# EAGLE design tophat (EAGLE 9.4.2)
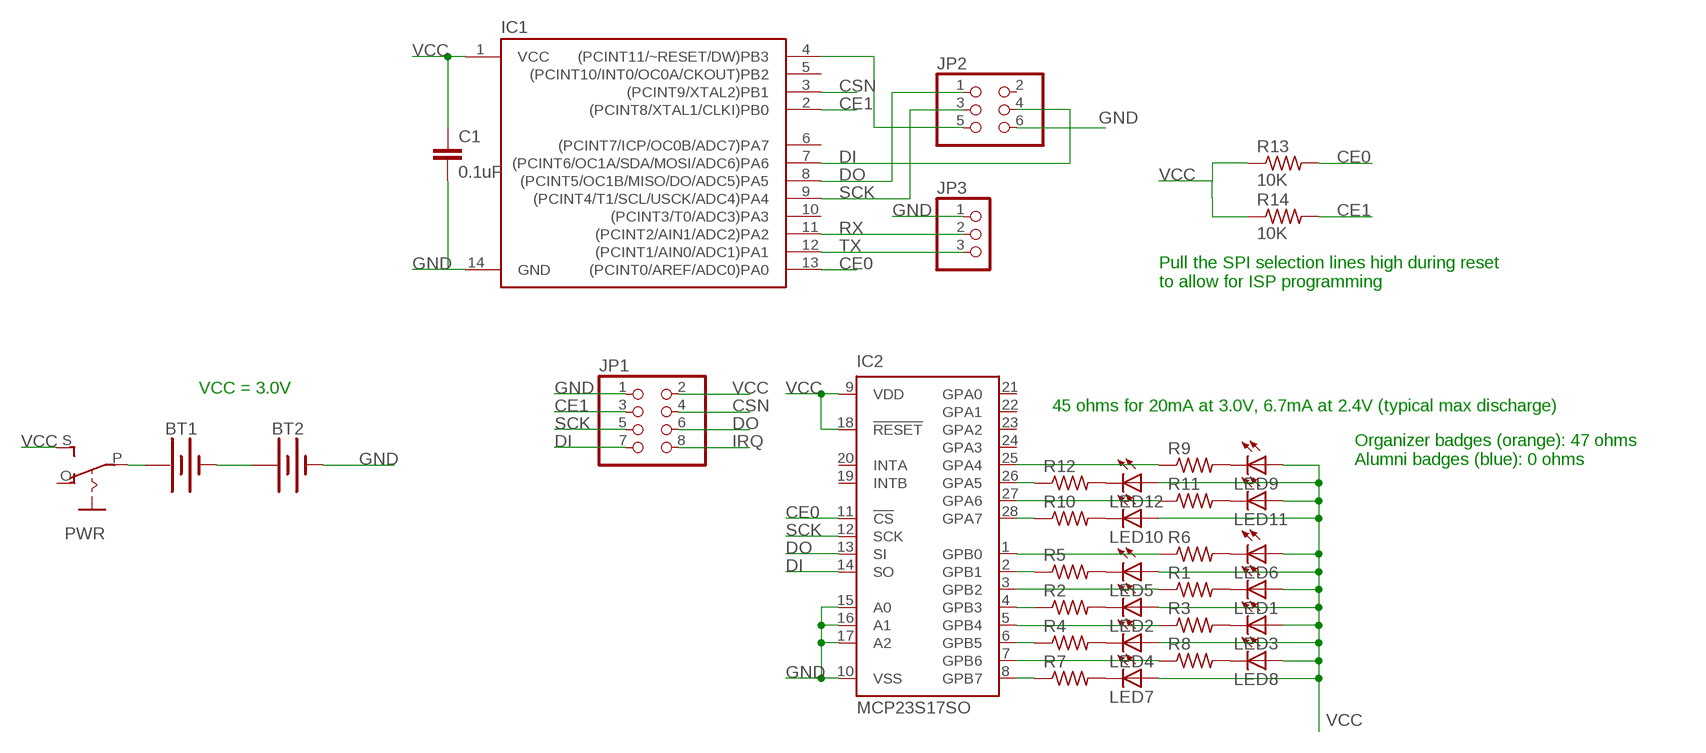
[diagram p0: schematic, sheet 1]

## Parts
BT1  BATTERY-AA-SMD  [BATTERY-AA-SMD]
BT2  BATTERY-AA-SMD  [BATTERY-AA-SMD]
C1  0.1uF  C-EUC1206  [C1206]
IC1  ATTINY84  [SO14]
IC2  MCP23S17SO  [SO28W]
JP1  PINHD-2X4/90  [2X04/90]
JP2  PINHD-2X3  [2X03]
JP3  PINHD-1X3  [1X03]
LED1  LEDSMT1206  [1206]
LED2  LEDSMT1206  [1206]
LED3  LEDSMT1206  [1206]
LED4  LEDSMT1206  [1206]
LED5  LEDSMT1206  [1206]
LED6  LEDSMT1206  [1206]
LED7  LEDSMT1206  [1206]
LED8  LEDSMT1206  [1206]
LED9  LEDSMT1206  [1206]
LED10  LEDSMT1206  [1206]
LED11  LEDSMT1206  [1206]
LED12  LEDSMT1206  [1206]
PWR  EG1218S  [EG1218]
R1  R-US_R1206  [R1206]
R2  R-US_R1206  [R1206]
R3  R-US_R1206  [R1206]
R4  R-US_R1206  [R1206]
R5  R-US_R1206  [R1206]
R6  R-US_R1206  [R1206]
R7  R-US_R1206  [R1206]
R8  R-US_R1206  [R1206]
R9  R-US_R1206  [R1206]
R10  R-US_R1206  [R1206]
R11  R-US_R1206  [R1206]
R12  R-US_R1206  [R1206]
R13  10K  R-US_R1206  [R1206]
R14  10K  R-US_R1206  [R1206]

## Nets
CE0: IC1.13((PCINT0/AREF/ADC0)PA0) IC2.11(!CS) R13.2
CE1: IC1.2((PCINT8/XTAL1/CLKI)PB0) JP1.3 R14.2
CSN: IC1.3((PCINT9/XTAL2)PB1) JP1.4
DI: IC1.7((PCINT6/OC1A/SDA/MOSI/ADC6)PA6) IC2.14(SO) JP1.7 JP2.4
DO: IC1.8((PCINT5/OC1B/MISO/DO/ADC5)PA5) IC2.13(SI) JP1.6 JP2.1
GND: BT2.P$2(-) BT2.P$4(-) C1.2 IC1.14(GND) IC2.10(VSS) IC2.15(A0) IC2.16(A1) IC2.17(A2) JP1.1 JP2.6 JP3.1
IRQ: JP1.8
N$1: BT1.P$2(-) BT1.P$4(-) BT2.P$1(+) BT2.P$3(+)
N$2: BT1.P$1(+) BT1.P$3(+) PWR.P
N$3: IC2.28(GPA7) R10.1
N$5: IC2.27(GPA6) R11.1
N$6: LED1.C R1.2
N$7: LED2.C R2.2
N$8: LED3.C R3.2
N$9: LED4.C R4.2
N$10: LED5.C R5.2
N$11: LED6.C R6.2
N$12: LED7.C R7.2
N$13: LED8.C R8.2
N$14: IC2.26(GPA5) R12.1
N$15: IC2.25(GPA4) R9.1
N$16: IC2.8(GPB7) R7.1
N$17: IC2.1(GPB0) R6.1
N$18: IC2.2(GPB1) R5.1
N$19: IC2.3(GPB2) R1.1
N$20: IC2.4(GPB3) R2.1
N$21: IC2.5(GPB4) R3.1
N$22: IC2.6(GPB5) R4.1
N$23: IC2.7(GPB6) R8.1
N$69: LED9.C R9.2
N$70: LED10.C R10.2
N$71: LED11.C R11.2
N$72: LED12.C R12.2
RST: IC1.4((PCINT11/~RESET/DW)PB3) JP2.5
RX: IC1.11((PCINT2/AIN1/ADC2)PA2) JP3.2
SCK: IC1.9((PCINT4/T1/SCL/USCK/ADC4)PA4) IC2.12(SCK) JP1.5 JP2.3
TX: IC1.12((PCINT1/AIN0/ADC1)PA1) JP3.3
VCC: C1.1 IC1.1(VCC) IC2.9(VDD) IC2.18(!RESET) JP1.2 LED1.A LED2.A LED3.A LED4.A LED5.A LED6.A LED7.A LED8.A LED9.A LED10.A LED11.A LED12.A PWR.S R13.1 R14.1
Unconnected: IC1.5((PCINT10/INT0/OC0A/CKOUT)PB2) IC1.6((PCINT7/ICP/OC0B/ADC7)PA7) IC1.10((PCINT3/T0/ADC3)PA3) IC2.19(INTB) IC2.20(INTA) IC2.21(GPA0) IC2.22(GPA1) IC2.23(GPA2) IC2.24(GPA3) JP2.2 PWR.O

## Notes on the sheet
- Pull the SPI selection lines high during reset
  to allow for ISP programming
- VCC = 3.0V
- 45 ohms for 20mA at 3.0V, 6.7mA at 2.4V (typical max discharge)
- Organizer badges (orange): 47 ohms
  Alumni badges (blue): 0 ohms

## Library data of the parts
BT1 BT2 = Batteries:BATTERY: Battery - Single Cell A variety of battery chemistries, sizes, and footprints. Device List: 20MM_PTH - Coin Cell Battery Holder - 20mm (PTH) <https://www.sparkfun.com/products/783> 6.8MM_PTH - Coin Cell Battery Holder - 6.8MM(SMD) <https://www.digikey.com/product-detail/en/seiko-instruments/MS621FE-FL11E/728-1057-ND/1889208?WT.srch=1&gclid=CNOQ5a6LzdQCFZS2wAodXCkE0g> 12MM_SMD - Coin Cell Battery Holder - 12mm (SMD) <https://www.sparkfun.com/products/10592> 12MM_PTH - Coin Cell Battery Holder - 12mm (PTH) <https://www.sparkfun.com/products/7948> 20MM_SMD - 20mm Coin Cell Battery Holder (SMD) (2 legs) Used on the Big Time Watch Kit <https://www.sparkfun.com/products/11734> 20MM_SMD_4LEGS - Coin Cell Battery Holder - 20mm (SMD) <https://www.sparkfun.com/products/11892> 20MM_SMD_4LEGS_OVERPASTE - Coin Cell Battery Holder - 20mm (SMD) <https://www.sparkfun.com/products/11892> (Over-paste on the legs) 24.5MM_PTH - Coin Cell Battery Holder - 24.5mm (PTH) <https://www.sparkfun.com/products/8863> 9V - 9V Battery Holder - PC Mount Used on the SparkFun SparkPunk Sound Kit <https://www.sparkfun.com/products/11177> and SparkFun SparkPunk Sequencer Kit <https://www.sparkfun.com/products/12707> 18650 - Battery Holder - 18650 (PTH) <https://www.sparkfun.com/products/13113> AA - Battery Holder - 1xAA (PTH) <https://www.sparkfun.com/products/7949> AAA - Battery Holder - 1xAAA (PTH) <https://www.sparkfun.com/products/12718> AA_KIT - Battery Holder - 1xAA (PTH) <https://www.sparkfun.com/products/7949> Special kit package - pads only have exposed copper on one side of the board. AAA_KIT - Battery Holder - 1xAAA (PTH) <https://www.sparkfun.com/products/12718> Special kit package - pads only have exposed copper on one side of the board.
C1 = rcl:C-EU: CAPACITOR, European symbol; SPICEPREFIX: C
IC1 = SparkFun-IC-Microcontroller:ATTINY84: Atmel 14-pin 2/4/8kB flash uC Datasheet <https://cdn.sparkfun.com/datasheets/Widgets/doc8006.pdf> SparkFun Products Tiny AVR Programmer <https://www.sparkfun.com/products/11801> (PGM-11801) SparkFun Servo Trigger - Continuous Rotation <https://www.sparkfun.com/products/13872> (WIG-13872) SparkFun Servo Trigger <https://www.sparkfun.com/products/13118> (WIG-13118); PROD_ID: IC-11285
IC2 = microchip:MCP23S17: http://ww1.microchip.com/downloads/en/DeviceDoc/21952a.pdf Source: http://ww1.microchip.com/downloads/en/DeviceDoc/21952a.pdf; MF: MICROCHIP; MPN: MCP23S17-E/SO; OC_FARNELL: unknown; OC_NEWARK: 31K2950
JP1 = pinhead:PINHD-2X4: PIN HEADER
JP2 = pinhead:PINHD-2X3: PIN HEADER
JP3 = adafruit:PINHD-1X3: PIN HEADER
LED1-LED12 = adafruit:LED: LED OSRAM: - CHIPLED LG R971, LG N971, LY N971, LG Q971, LY Q971, LO R971, LY R971 LH N974, LH R974 LS Q976, LO Q976, LY Q976 LO Q996 - Hyper CHIPLED LW Q18S LB Q993, LB Q99A, LB R99A - SideLED LS A670, LO A670, LY A670, LG A670, LP A670 LB A673, LV A673, LT A673, LW A673 LH A674 LY A675 LS A676, LA A676, LO A676, LY A676, LW A676 LS A679, LY A679, LG A679 - Hyper Micro SIDELED® LS Y876, LA Y876, LO Y876, LY Y876 LT Y87S - SmartLED LW L88C, LW L88S LB L89C, LB L89S, LG L890 LS L89K, LO L89K, LY L89K LS L896, LA L896, LO L896, LY L896 - TOPLED LS T670, LO T670, LY T670, LG T670, LP T670 LSG T670, LSP T670, LSY T670, LOP T670, LYG T670 LG T671, LOG T671, LSG T671 LB T673, LV T673, LT T673, LW T673 LH T674 LS T676, LA T676, LO T676, LY T676, LB T676, LH T676, LSB T676, LW T676 LB T67C, LV T67C, LT T67C, LS T67K, LO T67K, LY T67K, LW E67C LS E67B, LA E67B, LO E67B, LY E67B, LB E67C, LV E67C, LT E67C LW T67C LS T679, LY T679, LG T679 LS T770, LO T770, LY T770, LG T770, LP T770 LB T773, LV T773, LT T773, LW T773 LH T774 LS E675, LA E675, LY E675, LS T675 LS T776, LA T776, LO T776, LY T776, LB T776 LHGB T686 LT T68C, LB T68C - Hyper Mini TOPLED® LB M676 - Mini TOPLED Santana® LG M470 LS M47K, LO M47K, LY M47K Source: http://www.osram.convergy.de/
PWR = adafruit:EG1218: SLIDING SWITCH 0.1" spacing through hole, vertical SPDT slide switch http://www.ladyada.net/library/pcb/eaglelibrary.html
R1-R14 = rcl:R-US_: RESISTOR, American symbol; SPICEPREFIX: R

## Board
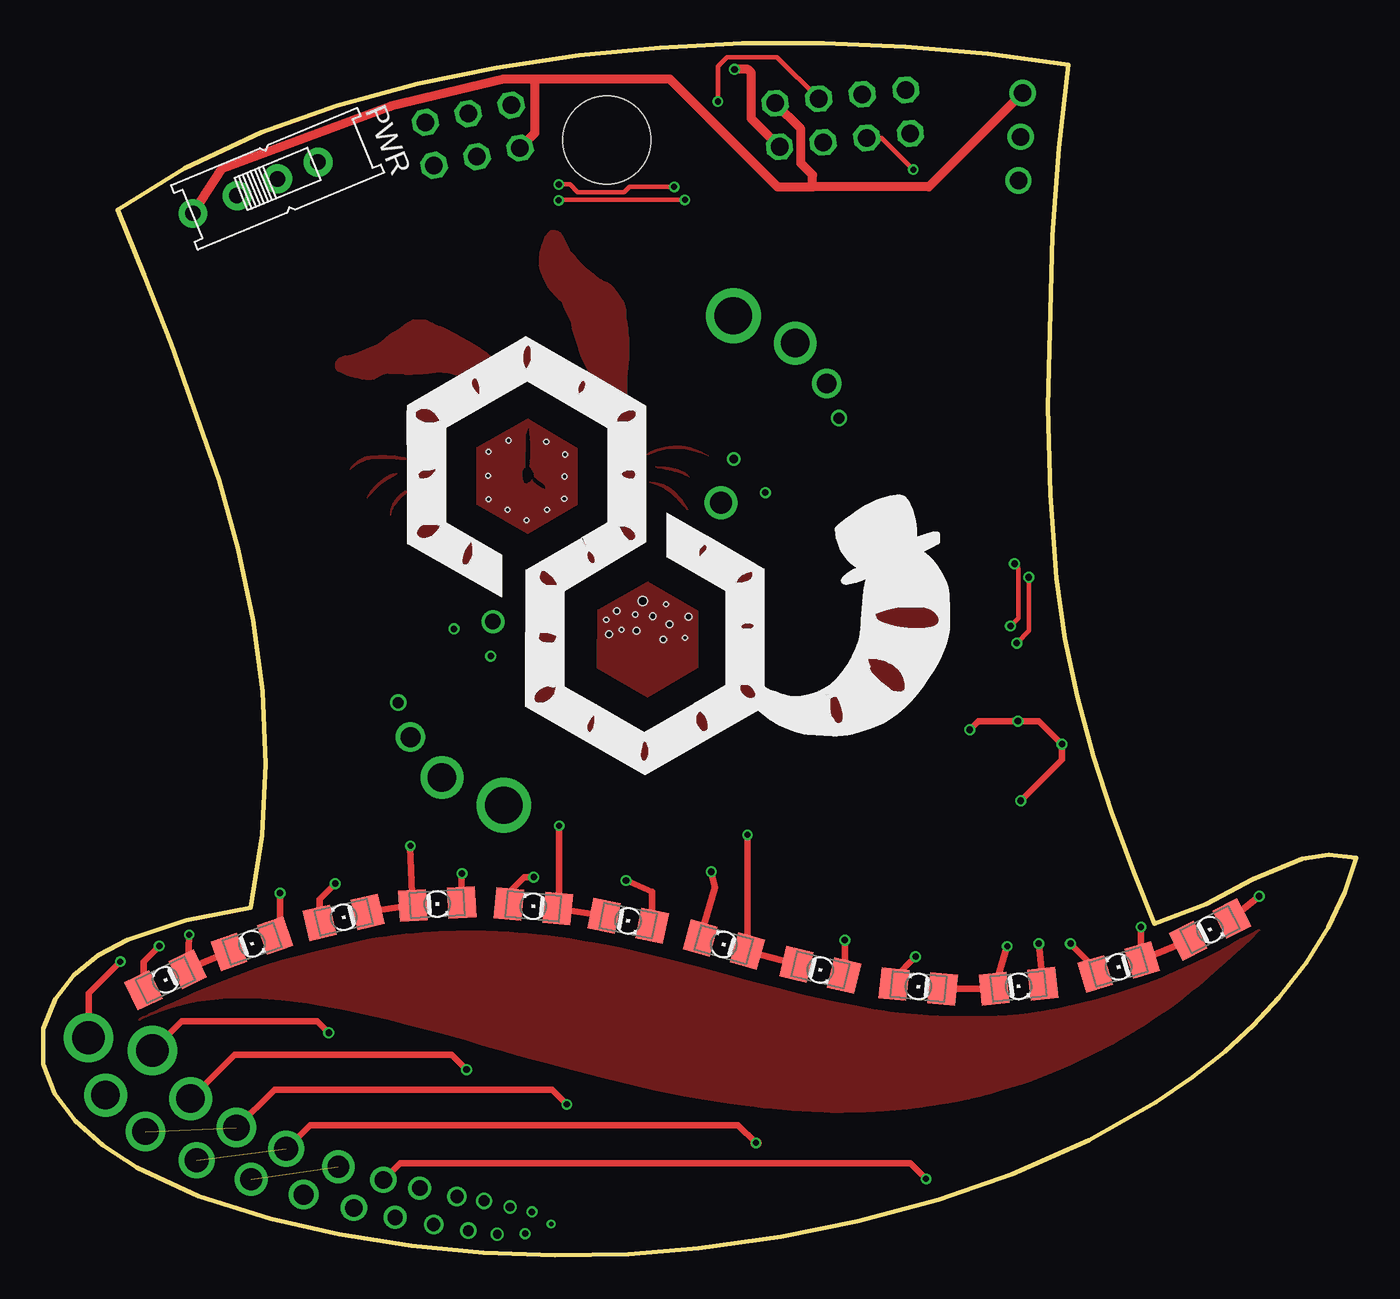
[diagram p1: board, top side]
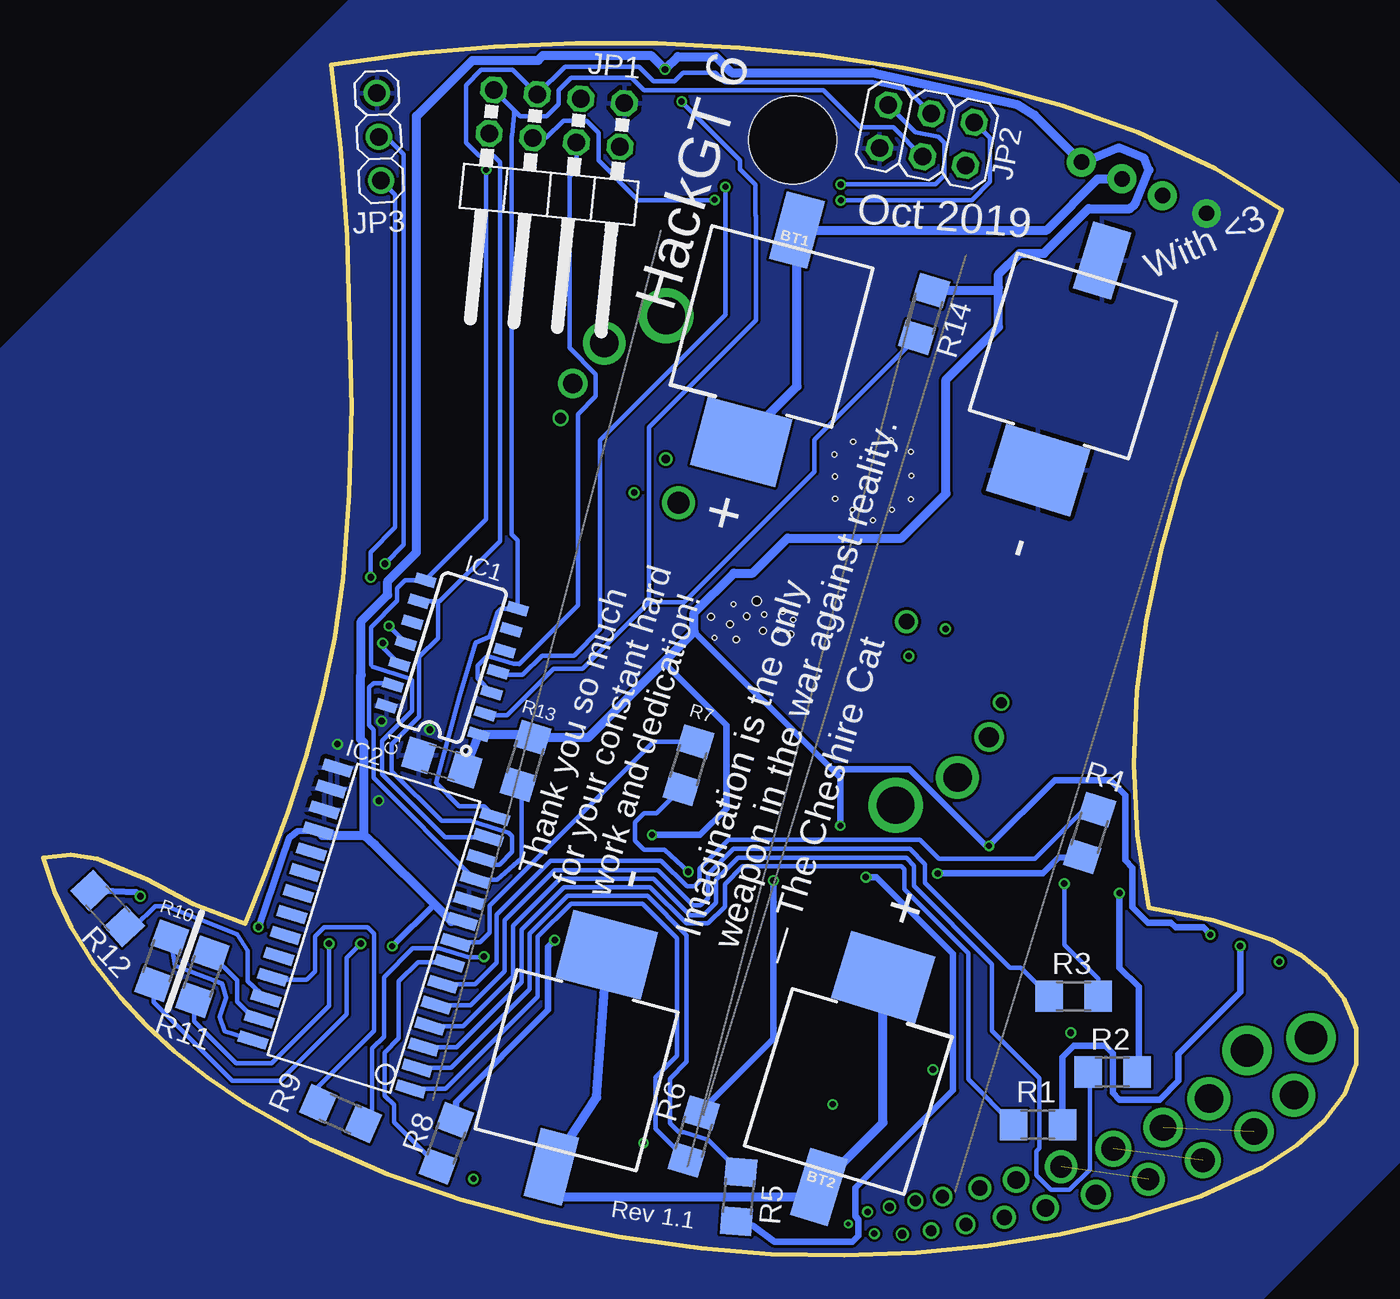
[diagram p2: board, bottom side, seen from below]

Size 76.15 x 70.27 mm. Coordinates in mm from the lower left corner, seen from the top.
Outline: 70.15,21.81 67.43,20.35 64.44,19.23 63.25,22.21 61.94,25.72 60.9,28.92 59.95,32.39 59.26,35.74 58.76,39.24 58.41,44.13 58.26,49.17 58.51,59.11 58.9,64.18 59.44,69 54.78,69.65 50.01,70.07 45.28,70.27 40.53,70.25 35.76,70.01 31.06,69.56 26.3,68.85 21.72,67.92 17.02,66.64 12.66,65.1 8.2,63.03 4.32,60.61 5.85,56.82 7.43,52.84 10.21,44.94 11.32,40.94 12.18,36.81 12.72,32.69 12.9,28.48 12.69,24.36 12.04,20.16 8.3,19.43 4.9,18.31 3.2,17.39 1.78,16.25 0.7,14.84 0,13.12 0,11.09 0.69,9.38 1.85,7.8 3.46,6.38 5.44,5.09 9.02,3.44 13.19,2.11 17.18,1.21 21.37,0.56 25.53,0.17 29.68,0 33.95,0.07 37.99,0.4 42.78,1.09 47.21,1.98 51.92,3.24 56.17,4.7 60.65,6.69 64.53,8.89 66.63,10.33 68.51,11.82 70.18,13.36 71.65,14.92 73.24,16.96 74.51,19.01 75.48,21.04 76.15,23.05 74.53,23.21 73.02,23 70.15,21.81
Copper layers (1*16): Top 0.035559375mm / dielectric 1.6mm / Bottom 0.035559375mm
Design rules "oshpark-2layer *": minimum track width 10mil, minimum drill 10mil, track to track 6mil, track to pad 6mil, pad to pad 6mil, via to via 6mil, smd to smd 6mil, copper to edge 0mil, drill to drill 6mil, minimum pad ring 5mil, minimum via ring 5mil, stop-mask expansion 2.5mil, vias tented up to drill 0mil, thermal gap 10mil
Holes 0.25 mm at 26.99,47.23 25.8,45.2 25.82,46.57 25.82,43.83 26.94,43.22 28.03,42.61 29.23,43.22 30.22,43.85 30.24,45.15 30.27,46.42 29.18,47.16 32.66,36.84 33.54,36.26 34.33,37.15 37.23,35.8 36.11,37.73
Holes 0.51 mm at 34.76,37.94
Holes 0.36 mm at 35.35,37.05 36.31,36.59 37.43,37.02 35.96,35.7 34.41,36.21 33.27,37.35 32.81,36.01
Holes 5.08 mm at 32.68,64.66
bKeepout: area 40.5,39 to 58.6,69.4
tRestrict: area 27.8,44.5 to 29.1,47.9

### Footprints (pad centres in the part's own frame; a part is rotated, then mirrored left to right if it is on the bottom)
BATTERY-AA-SMD = smd 4.064 x 2.286: P$1 -28.067,0; P$2 28.067,0 | smd 4.064 x 5.08: P$3 -15.367,0; P$4 15.367,0
C1206 = smd 1.6 x 1.8: 1 -1.4,0; 2 1.4,0
SO14 = smd 0.6 x 1.2: 1 -3.175,-2.8; 2 -1.905,-2.8; 3 -0.635,-2.8; 4 0.635,-2.8; 5 1.905,-2.8; 6 3.175,-2.8; 7 4.445,-2.8; 8 4.445,2.8; 9 3.175,2.8; 10 1.905,2.8; 11 0.635,2.8; 12 -0.635,2.8; 13 -1.905,2.8; 14 -3.175,2.8
SO28W = smd 0.65 x 1.7: 1 -7.62,-4.78; 2 -6.35,-4.78; 3 -5.08,-4.78; 4 -3.81,-4.78; 5 -2.54,-4.78; 6 -1.27,-4.78; 7 0,-4.78; 8 1.27,-4.78; 9 2.54,-4.78; 10 3.81,-4.78; 11 5.08,-4.78; 12 6.35,-4.78; 13 7.62,-4.78; 14 8.89,-4.78; 15 8.89,4.78; 16 7.62,4.78; 17 6.35,4.78; 18 5.08,4.78; 19 3.81,4.78; 20 2.54,4.78; 21 1.27,4.78; 22 0,4.78; 23 -1.27,4.78; 24 -2.54,4.78; 25 -3.81,4.78; 26 -5.08,4.78; 27 -6.35,4.78; 28 -7.62,4.78
2X04/90 = drill 1.016 octagon: 1 -3.81,-6.35; 2 -3.81,-3.81; 3 -1.27,-6.35; 4 -1.27,-3.81; 5 1.27,-6.35; 6 1.27,-3.81; 7 3.81,-6.35; 8 3.81,-3.81
2X03 = drill 1.016 octagon: 1 -2.54,-1.27; 2 -2.54,1.27; 3 0,-1.27; 4 0,1.27; 5 2.54,-1.27; 6 2.54,1.27
1X03 = drill 1.016: 1 -2.54,0; 2 0,0; 3 2.54,0
1206 = smd 1.6 x 1.803: A -1.422,0; C 1.422,0
EG1218 = drill 0.9 pad 1.676: O -2.54,0; P 0,0; S 2.54,0
R1206 = smd 1.6 x 1.803: 1 -1.422,0; 2 1.422,0

### Placement (x,y rotation side)
BT1  39.56,32.28 255.3 bottom
BT2  22.95,30.82 73 bottom
C1  53.03,28.57 162.8 bottom
IC1  52.63,34.06 72.8 bottom
IC2  57.15,18.35 72.8 bottom
JP1  46.88,60.85 174.2 bottom
JP2  24.9,64.93 168.6 bottom
JP3  56.67,64.83 272.7 bottom
LED1  7.1,15.97 205.4 top
LED2  12.11,18.07 19.3 top
LED3  17.43,19.6 193 top
LED4  22.85,20.37 3.3 top
LED5  28.42,20.23 174.6 top
LED6  33.92,19.4 348.5 top
LED7  39.47,18.02 164.6 top
LED8  45.06,16.55 346.5 top
LED9  50.75,15.58 174.4 top
LED10  56.56,15.6 6.1 top
LED11  62.35,16.72 196.5 top
LED12  67.65,18.89 27 top
PWR  13.59,62.4 22.5 top
R1  18.46,7.58 0 bottom
R2  14.14,10.63 0 bottom
R3  16.39,15.02 0 bottom
R4  15.47,24.48 252.2 bottom
R5  35.82,3.41 265.1 bottom
R6  38.42,6.89 72.9 bottom
R7  38.73,28.41 253 bottom
R8  52.77,6.5 69.9 bottom
R9  58.9,8.22 336.3 bottom
R10  69.26,17.08 250.3 bottom
R11  66.91,16.16 250.9 bottom
R12  72.4,20.11 132.8 bottom
R13  48.18,28.67 253 bottom
R14  25.06,54.57 253 bottom

### Tracks (layer width: path | path; a pad name or v marks a point on that pad's centre or on a via)
CE0
  Bottom 0.254: IC1.13 55.97,33.17 57,33.17 57.23,32.94 57.23,30.72 56.98,30.47 56.98,27.68 IC2.11 49.81,21.79 48.4,23.01 48.4,27.11 R13.2
CE1  (via drill 0.35)
  Top 0.254: JP1.3 42.56,69.46 39.65,69.46 39.12,68.93 v39.12,66.88
  Bottom 0.254: 41.02,37.85 44.87,34 46.56,34 49.24,31.32 50.43,31.32 | 41.02,37.85 41.02,48.01 34.82,54.21 34.82,60.26 34.83,60.27 34.83,62.05 35.73,62.96 35.73,63.49 v39.12,66.88 | 41.02,37.85 38.99,37.85 31.41,45.43 31.41,47.28 R14.2
  Bottom 0.381: IC1.2 50.43,31.32
CSN
  Bottom 0.254: JP1.4 45.23,62.94 45.64,62.53 45.64,52.6 44.12,51.08 44.12,49.79 45.14,48.77 45.14,37.69 48.56,34.27 48.57,34.28 48.88,34.28 50.24,34.7 50.44,34.7 50.97,34.18 50.97,33.45 IC1.3
DI
  Bottom 0.254: 48.83,66.36 48.49,66.02 46.97,66.02 46.26,66.73 46.26,67.52 45.53,68.26 42.04,68.26 41.3,67.53 30.9,67.53 28.76,65.38 26.85,65.38 JP2.4 | 48.83,66.36 JP1.7 | 48.83,66.36 48.83,66.12 48.96,64.89 48.98,64.87 48.98,41.8 48.64,41.47 IC1.7 49.6,37.47 49.84,37.24 49.84,37.19 50.25,35.86 51.07,35.51 51.99,32.41 53.37,27.4 52.02,26.05 50.58,26.05 IC2.14
DO  (via drill 0.35)
  Top 0.254: v50.46,62.93 48.61,64.77 JP1.6 | v37.21,61.18 29.92,61.18 v29.89,61.15
  Bottom 0.254: v50.46,62.93 50.46,42.66 IC1.8 55.17,39.13 55.61,38.68 55.61,37.94 57.14,36.41 57.14,34.23 57.03,34.11 54.85,33.44 | JP1.6 46.97,64.77 45.97,65.77 44.65,65.77 43.94,65.06 43.94,63.47 41.64,61.17 v37.22,61.17 v37.21,61.18 | IC2.13 50.36,24.24 52.84,24.24 56.49,27.89 56.49,29.83 54.75,31.57 54.75,33.33 54.85,33.44 | 54.85,33.44 | JP2.1 21.26,64.77 21.26,62.22 22.31,61.17 29.87,61.17 v29.89,61.15
GND  (via drill 0.38, 0.89 pad 1.65)
  Top 0.381: v53.73,30.47 54.22,30.96 v56.52,30.96 57.74,30.96 v59.07,29.64 59.07,28.74 v56.69,26.35
  Top 0.508: JP3.1 51.36,61.94 44.62,61.94 | 44.62,61.94 42.59,61.94 36.34,68.19 28.51,68.19 | 28.51,68.19 26.69,68.19 20.14,66.61 10.35,62.99 v8.68,60.4 | 28.51,68.19 28.51,65.05 JP2.6 | 44.62,61.94 44.62,62.64 43.94,63.32 43.94,65.29 JP1.1
  pour Bottom: 79.42,-3.59 79.42,51.78 57.57,73.62 9.06,73.62 -2.62,61.94 -2.62,5.55 7.03,-4.1
N$1
  Bottom 0.508: BT2.P$3 27.45,7.69 BT2.P$1 31.73,3.41 46.12,3.41 BT1.P$2 44.05,9.16 BT1.P$4
N$2
  Bottom 0.508: PWR.P 15,62.4 17.96,59.43 BT1.P$1 32.44,50.37 BT1.P$3
N$3
  Bottom 0.254: R10.1 68.49,16.78 66.25,15.95 65.77,15.75 65.54,14.93 65.92,13.83 65.63,12.98 IC2.28
N$4
  pour Top: 28.05,53.03 34.77,49.15 34.77,41.37 30.04,38.63 30.04,32.9 34.87,30.09 39.77,32.9 39.77,38.56 36.35,40.55 36.35,42.74 41.59,39.69 41.63,33.04 arc71 41.68,32.96 arc-7 41.77,32.93 arc-13 42.04,32.76 arc26 43.01,32.3 arc13 43.69,32.23 arc19 44.57,32.39 arc7 45.4,32.75 arc23 46.11,33.29 arc7 46.7,34.07 arc10 47.1,34.77 arc11 47.42,35.73 arc4 47.63,36.79 arc9 47.74,38.2 arc-18 47.9,39.26 arc46 47.88,39.46 47.71,39.38 arc-10 46.7,39.03 arc-45 46.52,39.06 arc-100 46.51,39.17 arc-11 46.73,39.39 arc-16 47.35,39.76 47.24,39.89 arc9 46.94,40.2 arc-40 46.05,41.85 arc-17 46.05,42.09 arc-35 46.12,42.24 arc-13 46.34,42.42 arc0 47.04,42.88 arc1 47.55,43.22 arc-12 48.38,43.67 arc-10 49.34,43.98 arc-15 49.68,44.01 arc-59 49.86,43.91 arc13 49.94,43.79 arc-28 50.16,43.38 arc4 50.28,42.98 arc-2 50.44,42.47 arc-15 50.51,42 arc1 50.52,41.41 50.94,41.57 arc-11 51.66,41.76 arc-81 51.78,41.69 arc-19 51.8,41.51 arc-38 51.75,41.38 arc-29 51.55,41.24 arc9 50.75,40.86 50.94,40.67 arc3 51.43,40.24 arc-22 51.71,39.9 arc9 51.88,39.62 arc-9 52.15,39.18 arc-26 52.37,38.27 arc0 52.39,37.18 arc-4 52.37,36.18 arc-24 52.13,35.31 arc7 51.94,34.88 arc-17 51.22,33.57 arc-3 50.23,32.35 arc-11 49.04,31.2 arc-19 48.12,30.7 arc-8 47.1,30.42 arc-5 46.07,30.28 arc-10 45.1,30.27 arc-12 43.6,30.53 arc-20 42.34,31.12 arc-1 41.44,31.77 40.12,31.01 34.91,28.03 28.15,31.91 28.15,39.62 32.95,42.36 32.95,48.02 28.12,50.87 23.18,48.06 23.18,42.36 26.44,40.48 26.44,38.39 21.29,41.37 21.29,49.12 24.14,50.8
N$5
  Bottom 0.254: R11.1 64.89,15.94 64.89,14.7 63.89,13.69 IC2.27
N$6  (via drill 0.38)
  Top 0.381: LED1.C 5.82,17.02 v6.74,17.93
  Bottom 0.381: v6.74,17.93 6.74,15.24 10.33,11.65 10.33,10.11 11.4,9.04 13.74,9.04 14.13,9.42 14.13,11.7 14.56,12.14 16.37,12.14 17.04,11.48 R1.2
N$7  (via drill 0.38)
  Top 0.381: v13.73,21 v13.74,20.99 13.74,18.82 LED2.C
  Bottom 0.381: R2.2 12.62,10.73 12.62,15.57 13.73,16.68 v13.73,21
N$8  (via drill 0.38)
  Top 0.381: LED3.C 16.04,20.66 v16.93,21.55 v16.94,21.55
  Bottom 0.254: R3.2 14.97,16.03 16.94,18 v16.94,21.55
N$9  (via drill 0.38)
  Top 0.381: LED4.C 24.27,22.12 v24.29,22.14
  Bottom 0.381: R4.2 17.27,23.06 18.19,22.14 v24.29,22.14
N$10  (via drill 0.38)
  Top 0.381: LED5.C 27,21.05 27.88,21.92 v28.44,21.92
  Bottom 0.254: R5.2 35.67,1.72
  Bottom 0.381: v28.44,21.92 27.83,21.92 23.39,17.49 23.39,9.57 29.06,3.91 29.06,2.26 28.86,2.06 28.86,1.15 29.23,0.78 33.74,0.78 34.97,1.72 35.67,1.72
N$11  (via drill 0.38)
  Top 0.381: LED6.C 35.31,21.08 v33.8,21.73
  Bottom 0.381: v33.8,21.73 33.8,12.56 38.03,8.33 R6.2
N$12  (via drill 0.38)
  Top 0.381: LED7.C 38.95,21.33 v38.74,22.24
  Bottom 0.254: v38.74,22.24 40.12,23.52 41.32,23.52 41.83,24.03 41.83,25.11 41.32,25.62 40.58,25.62 R7.2
N$13  (via drill 0.38 pad 0.38)
  Top 0.381: v46.48,18.27 46.48,16.59 46.45,16.55 LED8.C
  Bottom 0.381: v46.48,18.27 46.87,17.88 46.87,14.24 52.21,8.89 52.21,7.9 R8.2
N$14
  Bottom 0.254: R12.1 70.83,19.07 69.64,20.25 68.97,20.25 64.9,18.63 64.29,17.67 64.3,15.9 IC2.26
N$15
  Bottom 0.254: R9.1 60.2,9.78 56.96,13.03 56.96,18.65 57.32,19.01 59.86,19.01 60.37,18.51 60.37,16.47 60.88,15.97 62.69,15.97 IC2.25
N$16
  Bottom 0.254: IC2.8 50.82,18.15 50.26,18.7 50.26,20.27 40.76,29.77 R7.1
N$17
  Bottom 0.254: IC2.1 52.8,9.65 47.46,14.99 47.46,18.47 45.53,20.4 41.38,20.4 39.38,18.4 39.38,11.58 40.64,10.32 40.64,7.34 R6.1
N$18
  Bottom 0.254: IC2.2 52.48,10.87 47.93,15.42 47.93,18.66 45.74,20.85 41.11,20.85 38.83,18.56 38.83,11.22 39.81,10.24 39.81,7.67 39.27,7.13 38.98,7.13 37.58,6.7 R5.1
N$19
  Bottom 0.254: IC2.3 52.17,12.08 48.41,15.84 48.41,18.88 45.95,21.34 40.95,21.34 38.85,19.24 37.6,19.24 36.62,20.22 36.62,21.52 35.58,22.56 26.38,22.56 26.21,22.39 26.21,21.24 22.5,17.52 22.5,10.2 R1.1
N$20
  Bottom 0.254: IC2.4 51.8,13.29 48.9,16.19 48.9,19.11 46.18,21.83 40.75,21.83 38.64,19.72 37.85,19.72 37.12,20.45 37.12,21.79 35.87,23.04 26.1,23.04 25.66,22.59 25.66,21.42 21.12,16.89 21.12,13.01 18.38,10.27 18.38,6.21 18.55,6.04 18.55,4.64 17.71,3.8 16.64,3.8 15.46,4.98 15.46,10.53 R2.1
N$21
  Bottom 0.254: R3.1 19.45,16.66 20.08,16.66 25.01,21.59 25.01,22.68 25.89,23.56 36.12,23.56 37.6,22.08 37.6,20.72 38.03,20.28 38.45,20.28 40.49,22.32 46.49,22.32 49.39,19.43 49.39,16.48 51.36,14.51 IC2.5
N$22
  Bottom 0.254: IC2.6 51.11,15.72 49.86,16.97 49.86,19.74 46.72,22.88 40.31,22.88 38.82,21.39 38.38,21.39 38.09,21.68 38.09,22.41 36.4,24.09 25.32,24.09 24.21,22.99 18.64,22.99 15.8,25.83 R4.1
N$23
  Bottom 0.254: R8.1 55.8,7.71 55.8,8.72 56.34,9.26 56.34,11.76 55.52,12.57 55.52,15.9 54.42,17 52.66,17 IC2.7
N$24
  pour Top: 28.08,48.5 30.96,46.79 30.96,43.5 28.08,41.82 25.17,43.5 25.17,46.86
N$25
  pour Top (no thermals): 8.56,15.15 8.74,15.22 arc-3 12.35,16.64 arc-6 14.48,17.3 arc-2 18.9,18.35 arc-3 20.53,18.58 arc-2 22.03,18.73 arc-4 23.42,18.8 arc-1 24.95,18.83 arc-5 27.03,18.75 arc0 28.58,18.63 arc-6 30.51,18.37 arc1 31.83,18.14 arc-4 34.37,17.64 arc-2 39.81,16.24 arc1 42.55,15.5 arc2 44.86,14.94 arc2 48.14,14.28 arc4 49.59,14.08 arc1 50.7,13.98 arc3 52.51,13.88 arc5 55.94,13.93 arc9 58.86,14.33 arc0 60.35,14.66 arc6 62.51,15.27 arc-1 63.81,15.71 arc1 63.89,15.73 arc6 65.33,16.31 arc-2 66.58,16.87 arc7 68.99,18.09 arc-4 70.49,18.91 70.54,18.85 70.44,18.75 arc-25 70.44,18.75 arc-6 69.19,17.56 arc1 67.24,15.83 arc-7 66.53,15.27 arc7 66.44,15.18 arc-11 64.7,13.93 arc7 64.55,13.83 arc-7 63.33,13.01 62.29,12.4 arc-4 61.29,11.87 arc1 61.09,11.77 arc-2 59.57,11.03 arc-3 57.89,10.32 arc-5 56.09,9.71 arc1 54.89,9.36 arc-8 54.03,9.15 arc9 53.83,9.1 arc-5 53.65,9.05 arc-4 52.48,8.82 arc-1 50.78,8.57 arc-5 48.75,8.36 arc-1 47.17,8.29 arc-6 44.89,8.31 arc0 44,8.36 arc-2 42.3,8.49 arc-2 40.72,8.67 arc-2 38,9.08 arc-3 35.39,9.58 arc-2 32.52,10.27 arc0 30.18,10.88 arc0 27.33,11.64 arc-2 25.05,12.3 arc2 23.17,12.83 arc0 20.02,13.65 arc5 16.06,14.49 arc4 13.82,14.79 arc9 10.42,14.87 arc10 8.13,14.54 arc13 5.64,13.65 arc-16 5.57,13.62 5.54,13.67 5.59,13.72 arc-37 5.64,13.75 arc37 5.69,13.77 arc-37 5.85,13.85 arc27 5.97,13.9 arc-9 6.23,14.05 arc-3 7.09,14.46 arc2
N$26
  pour Top: 32.17,37.43 35.04,39.05 37.94,37.38 37.94,34.05 35.04,32.35 32.15,34.02
N$27
  pour Top: 26,52.06 25.9,52.16 arc13 25.65,52.36 arc-1 25.27,52.6 arc3 24.85,52.87 arc2 24.37,53.14 arc0 23.85,53.42 arc3 23.31,53.7 arc8 22.91,53.86 arc-10 22.68,53.96 arc6 22.27,54.16 arc24 21.98,54.22 arc-3 21.63,54.22 arc32 21.29,54.13 arc5 20.9,53.87 arc-5 20.36,53.52 arc12 19.73,53.06 arc-21 19.12,52.67 arc1 18.2,52.29 arc-16 17.57,52.12 arc24 17.18,51.99 arc43 16.94,51.68 arc44 16.97,51.42 arc37 17.13,51.26 arc2 17.48,51.1 arc11 18.06,50.91 arc3 18.69,50.79 arc19 19.05,50.79 arc20 19.37,50.9 arc-5 19.77,51.11 arc-33 20.04,51.14 arc13 20.39,51.13 arc-17 20.93,51.09 arc17 21.2,51.07 arc-4 21.82,51.1 arc10 22.33,51.14 arc-8 22.95,51.21 arc-12 23.37,51.18 arc-3 23.75,51.09 arc-13 24.09,50.97
N$28
  pour Top: 31.87,50.84 31.74,51.09 arc5 31.49,51.55 arc-15 31.11,52.41 arc3 30.78,53.44 arc-12 30.67,53.91 arc29 30.5,54.37 arc-13 30.37,54.6 arc-2 30.12,55.23 arc48 29.99,55.36 arc-25 29.91,55.41 arc-1 29.56,55.79 arc-16 29.18,56.35 arc-1 28.9,56.94 arc-23 28.8,57.37 arc-3 28.8,57.88 arc-16 28.87,58.33 arc-4 29.07,58.92 arc-30 29.4,59.37 arc-47 29.58,59.42 arc-1 29.72,59.41 arc-41 29.98,59.27 arc-18 30.24,58.83 arc2 30.45,58.36 arc23 30.66,58.08 arc-11 30.84,57.89 arc7 31.29,57.38 arc10 31.63,57.09 arc-8 32.01,56.8 arc23 32.54,56.48 arc-32 33.06,56.1 arc-5 33.56,55.39 arc-37 33.76,54.64 arc21 33.82,54.14 arc-18 33.89,53.58 arc12 33.91,53.34 arc-11 33.95,52.89 arc-1 33.93,51.97 arc-7 33.86,51.2 arc8 33.83,50.79 arc-2 33.81,49.73
N$29
  pour Top: 24.07,50.97 24.25,50.84 26.13,51.93 26,52.06
N$30
  pour Top: 21.12,46.14 21.02,46.19 arc16 20.87,46.24 arc16 18.97,46.32 arc27 18.37,46.11 arc19 17.8,45.58 18.07,45.78 arc-27 19.07,46.19 arc-11 19.35,46.21 arc3 19.47,46.21 arc-8 20.43,46.17 arc8 21.12,46.13 arc177
N$31
  pour Top: 20.51,45.3 20.43,45.3 arc28 19.91,45.12 arc18 19.04,44.36 arc21 18.79,43.91 18.91,44.05 arc-1 19.31,44.47 arc-12 19.7,44.81 arc-6
N$32
  pour Top: 21.12,44.31 21.06,44.31 arc29 20.92,44.25 arc9 20.59,43.99 arc31 20.16,43.27 arc23 20.13,42.93 arc188 20.17,42.93 arc-59 20.17,42.96 20.18,42.99 arc-28 20.46,43.6 arc-9 20.92,44.08 arc-10 21.12,44.24 arc117
N$33
  pour Top: 34.94,46.42 35.12,46.52 arc-11 35.63,46.75 arc-19 36.76,46.93 arc-24 37.98,46.67 arc-9 38.57,46.36 38.55,46.34 38.47,46.37 arc8 37.48,46.67 arc19 36.34,46.75 arc17 35.42,46.52 arc-8 34.97,46.37 arc-156
N$34
  pour Top: 35.55,45.73 35.85,45.72 arc-10 36.55,45.63 arc-20 37.18,45.38 arc-24 37.44,45.14 37.34,45.18 arc-5 37.15,45.26 arc14 36.78,45.4 arc1 36.29,45.51 arc1 35.7,45.63 arc-15 35.55,45.68 arc-128
N$35
  pour Top: 35.2,44.85 35.52,44.81 arc-24 36.17,44.58 arc-14 36.69,44.18 arc-10 37.06,43.74 arc-6 37.37,43.24 arc-185 37.34,43.23 arc21 37.27,43.33 arc-4 37.04,43.58 arc6 36.65,43.98 arc25 35.46,44.69 arc0 35.2,44.78 arc-130
N$36  (via drill 2.16 pad 0.25)
  other vias: 40.02,54.47
N$37  (via drill 1.65)
  other vias: 43.6,52.87
N$38  (via drill 1.14)
  other vias: 45.43,50.53
N$39  (via drill 0.64)
  other vias: 46.14,48.53
N$40  (via drill 2.16 pad 0.25)
  other vias: 26.71,26.1
N$41  (via drill 1.65)
  other vias: 23.13,27.7
N$42  (via drill 1.14)
  other vias: 21.3,30.04
N$43  (via drill 0.64)
  other vias: 20.59,32.04
N$44  (via drill 0.38)
  other vias: 28.34,2.53
N$45  (via drill 0.35, 1.91)
  Top 0.381: v4.47,17.03 2.63,15.18 v2.63,12.61
N$46  (via drill 0.38, 1.91)
  Top 0.381: v6.34,11.88 8.03,13.57 15.9,13.57 v16.56,12.9
N$47  (via drill 1.65)
  other vias: 3.62,9.29
N$48  (via drill 0.38, 1.65)
  Top 0.381: v8.55,9.08 11.11,11.64 23.68,11.64 v24.55,10.76
N$49  (via drill 0.35, 1.52)  (1 unrouted)
  Top 0.381: v11.21,7.41 13.42,9.62 29.5,9.62 v30.36,8.75
  other vias: 5.94,7.18
N$50  (via drill 0.35, 1.4)  (1 unrouted)
  Top 0.381: v14.09,6.17 15.47,7.56 40.3,7.56 v41.34,6.52
  Top 0.635: v41.34,6.52 v41.33,6.52
  other vias: 8.91,5.53
N$51  (via drill 1.27)  (1 unrouted)
  other vias: 12.06,4.41 17.12,5.14
N$52  (via drill 1.14)
  other vias: 15.1,3.52
N$53  (via drill 1.02)
  other vias: 18.03,2.76
N$54  (via drill 0.89)
  other vias: 20.41,2.2
N$55  (via drill 0.76)
  other vias: 22.65,1.79
N$56  (via drill 0.64)
  other vias: 24.65,1.44
N$57  (via drill 0.51)
  other vias: 26.33,1.23
N$58  (via drill 0.38)
  other vias: 27.96,1.26
N$59  (via drill 0.25)
  other vias: 29.46,1.82
N$60  (via drill 0.89)
  other vias: 26.08,36.74
N$61  (via drill 0.38)
  other vias: 23.82,36.31
N$62  (via drill 0.38)
  other vias: 25.95,34.74
N$63  (via drill 0.35, 1.02)
  Top 0.381: v19.73,4.38 20.7,5.35 50.28,5.35 v51.19,4.44
N$64  (via drill 0.89)
  other vias: 21.84,3.9
N$65  (via drill 0.76)
  other vias: 23.99,3.42
N$66  (via drill 0.64)
  other vias: 25.57,3.16
N$67  (via drill 0.51)
  other vias: 27.07,2.81
N$68  (via drill 1.27)
  other vias: 39.31,43.63
N$69  (via drill 0.38)
  Top 0.381: LED9.C 49.36,16.07 v50.58,17.32
  Bottom 0.254: R9.2 57.6,7.9 57.07,8.43 57.07,12.01 56.39,12.69 56.39,16.14 54.71,17.81 53.18,17.81 51.47,17.28 50.62,17.28 v50.58,17.32
N$70  (via drill 0.38)
  Top 0.381: LED10.C v57.74,18.06 v57.73,18.07
  Bottom 0.254: R10.2 69.74,14.67 65.19,10.12 62.4,10.12 58.55,13.98 58.55,17.25 v57.73,18.07
N$71  (via drill 0.38)
  Top 0.381: v59.57,18.07 60.65,16.99 60.65,16.32 LED11.C
  Bottom 0.254: R11.2 67.38,13.58 64.94,11.14 62.91,11.14 59.57,14.47 v59.57,18.07
N$72  (via drill 0.38)
  Top 0.381: LED12.C 70.48,20.79 v70.51,20.82
  Bottom 0.381: R12.2 70.75,21.05 v70.51,20.82
N$73  (via drill 0.51)
  other vias: 40.05,46.17
N$74  (via drill 0.38)
  other vias: 41.88,44.21
RST  (via drill 0.35)
  Top 0.254: v29.9,62.07 30.54,62.07 30.99,61.63 33.69,61.63 34,61.94 v36.59,61.94
  Bottom 0.254: v36.59,61.94 36.59,54.52 43.86,47.25 43.86,36.29 45.38,34.77 47.22,34.77 48.33,33.65 49.58,33.65 IC1.4 | JP2.5 25.56,65.1 24.22,64.83 23.88,64.49 23.88,62.62 24.42,62.08 v29.89,62.08 v29.9,62.07
RX  (via drill 0.38)
  Top 0.254: v56.09,36.48 56.54,36.94 56.54,39.82 56.3,40.07 v56.32,40.09
  Bottom 0.254: IC1.11 56.09,36.46 v56.09,36.48 | v56.32,40.09 55.23,41.18 55.23,63.81 56.25,64.84 JP3.2
SCK
  Bottom 0.254: IC1.9 53.26,37.92 | 53.26,37.92 53.15,37.92 49.66,41.4 49.66,63.36 50.03,63.73 50.87,63.73 51.62,64.48 51.62,67.83 50.74,68.71 48.91,68.71 JP1.5 45.89,68.91 41.6,68.91 40.75,68.05 39.54,68.05 39.04,68.54 37.15,68.54 36.61,68 28.03,68 26.03,67.56 JP2.3 | IC2.12 50.38,23 50.04,22.66 49.68,22.66 48.94,23.39 48.94,24.29 49.16,24.51 51.36,25.19 53.04,25.19 55.93,28.07 55.93,29.64 54.34,31.23 54.34,34.69 53.26,35.78 53.26,37.92
TX  (via drill 0.38)
  Top 0.254: v56.45,35.49 57.16,36.2 57.16,39.3 v57.15,39.31
  Bottom 0.254: IC1.12 56.44,35.22 56.44,35.48 v56.45,35.49 | v57.15,39.31 57.16,39.32 57.16,40.76 55.73,42.2 55.73,61.47 JP3.3
VCC  (via drill 0.35, 0.38)
  Top 0.381: v63.65,19.04 63.65,18.85 63.65,18.84 63.65,17.19 LED11.A LED12.A | LED9.A LED10.A 55.89,17.89 v55.9,17.92 | LED8.A LED7.A v40.84,24.38 | LED6.A LED5.A 29.92,20.89 v29.92,24.91 | LED3.A LED4.A 21.28,23.67 v21.3,23.74 | LED2.A LED1.A 8.46,18.48 v8.47,18.59
  Top 0.508: JP1.2 41.06,65.9 41.06,68.54 40.87,68.74 v40.09,68.74
  Bottom 0.381: v63.65,19.04 61.89,24.22 61.4,24.58 IC2.18 | v55.9,17.92 53.45,20.34 | v29.92,24.91 29.92,27.68 30.42,28.18 | 30.42,28.18 38.4,36.16 | 30.42,28.18 25.92,28.18 21.47,23.74 v21.3,23.74 17.48,27.55 14.28,27.55 13.4,26.68 13.4,22.9 12.98,22.48 12.98,20.18 12.09,19.29 10.75,19.29 10.48,19.01 8.89,19.01 v8.47,18.59 | v40.84,24.38 38.05,24.38 36.52,25.9 36.52,30.73 40.17,34.38
  Bottom 0.508: IC2.18 59.95,24.34 57.55,24.34 | IC2.9 52.47,19.36 53.45,20.34 56.92,23.81 57.55,24.34 | 57.55,24.34 57.55,29.72 57.76,29.94 57.76,33.59 57.69,33.66 57.69,36.75 56.16,38.28 56.16,39.08 54.5,40.74 54.5,66.03 51.26,69.27 47.45,69.27 47.16,69.56 40.9,69.56 v40.09,68.74 39.34,69.48 37.14,69.48 36.22,68.56 28.03,68.56 19.69,66.72 18.66,66.09 PWR.S 15.77,63.37 13.77,64.2 12.31,63.59 12.02,62.91 12.82,60.97 13.12,60.67 15.53,60.67 18.12,58.09 19.52,58.09 20.74,56.86 20.74,56.1 | C1.1 IC1.1 47.93,30.2 R13.1 44.53,30.03 40.17,34.38 38.4,36.16 38.4,37.25 36.1,39.55 35.01,39.55 32.98,41.58 26.38,41.58 23.79,44.16 23.79,50.76 20.74,53.81 20.74,56.1 | R14.1 20.91,55.93 20.74,56.1

### Text on the board
bNames: HackGT 6 | With <3 | Oct 2019 | IC1 | IC2 | Thank you so much / for your constant hard / work and dedication! | Imagination is the only / weapon in the war against reality. | — The Cheshire Cat | Rev 1.1
tStop: 0 | 1 | 1 | 1 | 0 | 1 | 0 | 1 | 1 | 1 | 0 | 0 | 0 | 1 | 0 | 1 | 0 | 0 | 1 | 1 | 0 | 1 | 1 | 1 | 0 | 1 | 0 | 0 | 1 | 1 | 0 | 0 | 1 | 1 | 0 | 1 | 0
206bmp: C:/Users/petsc/Downloads/logo.bmp